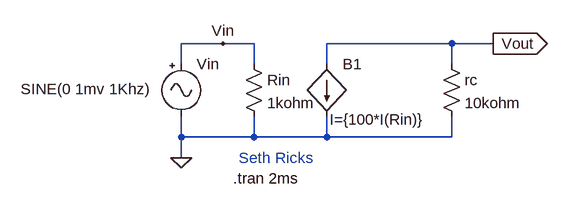
[diagram p0: schematic pi_BJT_model.asc]
pi_BJT_model.asc, the LTspice schematic file:
Version 4.1
SHEET 1 880 680
WIRE -96 -448 -160 -448
WIRE -48 -448 -96 -448
WIRE 256 -448 64 -448
WIRE 320 -448 256 -448
WIRE -160 -416 -160 -448
WIRE -48 -416 -48 -448
WIRE 64 -416 64 -448
WIRE 256 -416 256 -448
WIRE -160 -304 -160 -336
WIRE -48 -304 -48 -336
WIRE -48 -304 -160 -304
WIRE 64 -304 64 -336
WIRE 64 -304 -48 -304
WIRE 256 -304 256 -336
WIRE 256 -304 64 -304
WIRE -160 -272 -160 -304
FLAG -160 -272 0
FLAG -96 -448 Vin
FLAG 320 -448 Vout
IOPIN 320 -448 Out
SYMBOL bi 64 -416 R0
WINDOW 3 4 85 Left 2
SYMATTR InstName B1
SYMATTR Value I={100*I(Rin)}
SYMBOL res 240 -432 R0
SYMATTR InstName rc
SYMATTR Value 10kohm
SYMBOL Misc\\signal -160 -432 R0
WINDOW 3 -247 54 Left 2
WINDOW 123 0 0 Left 0
WINDOW 39 0 0 Left 0
SYMATTR InstName Vin
SYMATTR Value SINE(0 1mv 1Khz)
SYMBOL res -64 -432 R0
SYMATTR InstName Rin
SYMATTR Value 1kohm
TEXT -72 -272 Left 2 ;Seth Ricks
TEXT -80 -240 Left 2 !.tran 2ms

The netlist it stands for:
* pi_BJT_model.asc
B1 Vout 0 I={100*I(Rin)}
rc Vout 0 10kohm
Vin Vin 0 SINE(0 1mv 1Khz)
Rin Vin 0 1kohm
* Seth Ricks
.tran 2ms
.backanno
.end

* Results of the author's LTspice run, read from the files saved beside the schematic
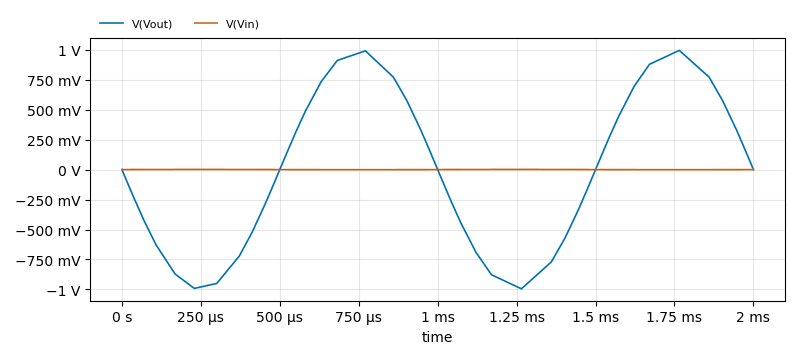
[diagram p1: Transient Analysis of pi_BJT_model.asc, plotted from the saved traces]
* Transient Analysis, 1 run:
*   V(Vout): min -994.6 mV, max 994.6 mV, average -776.4 µV, rms 697.6 mV, last 0 V
*   V(Vin): min -994.7 µV, max 994.7 µV, average 775.6 nV, rms 697.6 µV, last 0 V